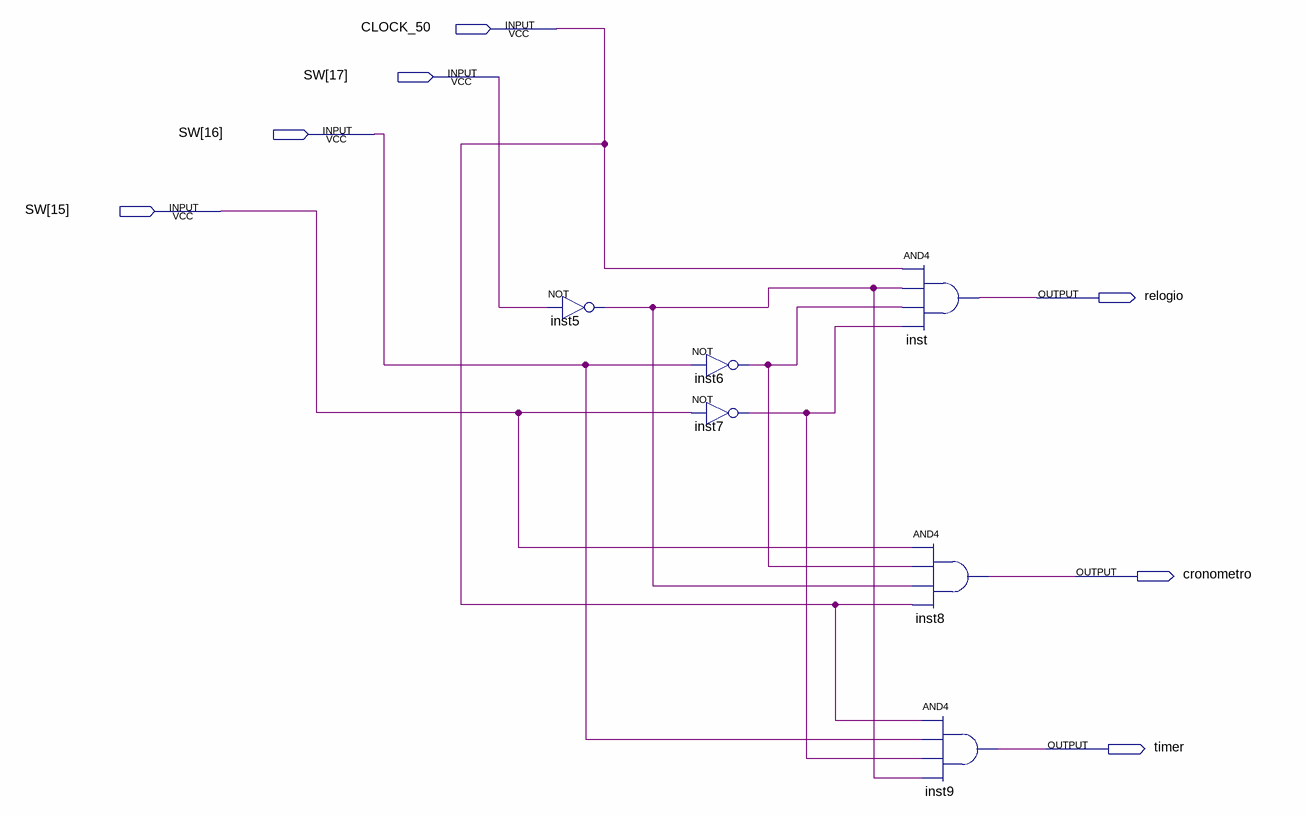
[diagram p0: schematic sheet]
// Quartus schematic controle.bdf as structural Verilog: 6 symbols, 7 pins
module controle (
  input  CLOCK_50,
  input  [17:15] SW,
  output relogio,
  output cronometro,
  output timer
);

  wire inst5_out, inst6_out, inst7_out;

  not inst5 (inst5_out, SW[17]);
  not inst6 (inst6_out, SW[16]);
  not inst7 (inst7_out, SW[15]);
  and inst (relogio, CLOCK_50, inst5_out, inst6_out, inst7_out);
  and inst8 (cronometro, SW[15], inst6_out, inst5_out, CLOCK_50);
  and inst9 (timer, CLOCK_50, SW[16], inst7_out, inst5_out);
endmodule
